# EAGLE design HC-SR04_to_I2C_v1 (EAGLE 7.5.0)
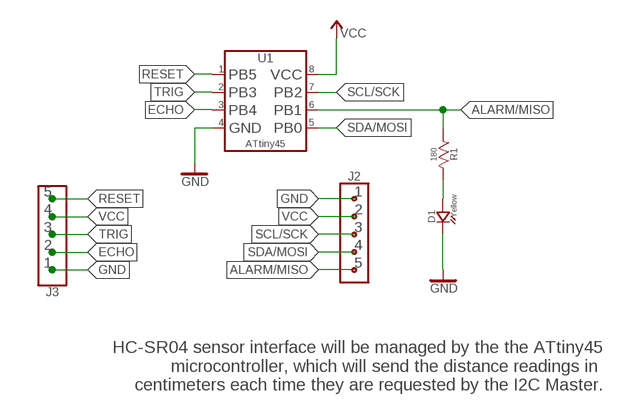
[diagram p0: schematic, sheet 1]

## Parts
D1  Yellow  LED_0805[2012]  [0805[2012]]
J2  PIN_HEADER_1X05_0.1"_STR_G[1]_PTH  [PIN_HEADER_1X05_0.1"_STR_G[1]_PTH]
J3  PIN_HEADER_1X05_0.1"_STR_G[1]_PTH  [PIN_HEADER_1X05_0.1"_STR_G[1]_PTH]
R1  180  RESISTOR_0603[1008]  [0603[1608]]
U1  ATtiny45  ATTINY25/45/85_TSSOP_MO-153-AC  [TSSOP_MO-153-AC]

## Nets
ALARM/MISO: J2.5 R1.1 U1.6(PB1)
ECHO: J3.2 U1.3(PB4)
GND: D1.- J2.1 J3.1 U1.4(GND)
N$9: D1.+ R1.2
RESET: J3.5 U1.1(PB5)
SCL/SCK: J2.3 U1.7(PB2)
SDA/MOSI: J2.4 U1.5(PB0)
TRIG: J3.3 U1.2(PB3)
VCC: J2.2 J3.4 U1.8(VCC)

## Notes on the sheet
- HC-SR04 sensor interface will be managed by the the ATtiny45
  microcontroller, which will send the distance readings in 
  centimeters each time they are requested by the I2C Master.

## Library data of the parts
D1 = LuisLab-LED:LED: LED 5MM
J2 J3 = LuisLab-Connectors:PIN_HEADER_1X05
R1 = LuisLab-Pasives:RESISTOR: Sschematic elements and footprints resistors
U1 = LuisLab-IntegratedCircuits:ATTINY25/45/85: Pin Descriptions - Port B (PB5:PB0) PB0 (MOSI/DI/SDA/AIN0/OC0A/OC1A/AREF/PCINT0) PB1 (MISO/DO/AIN1/OC0B/OC1A/PCINT1) PB2 (SCK/USCK/SCL/ADC1/T0/INT0/PCINT2) PB3 (PCINT3/XTAL1/CLKI/OC1B/ADC3) PB4 (PCINT4/XTAL2/CLKO/OC1B/ADC2) PB5 (PCINT5/RESET/ADC0/dW) NOTE: TSSOP only for ATtiny45/V

## Board
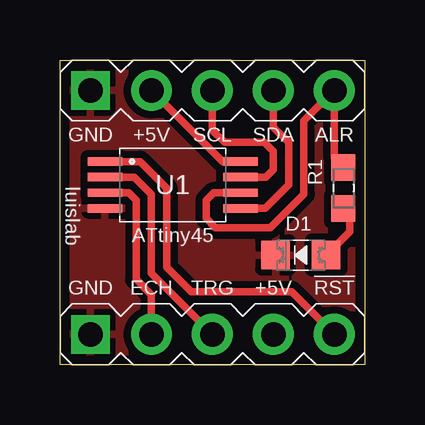
[diagram p1: board, top side]
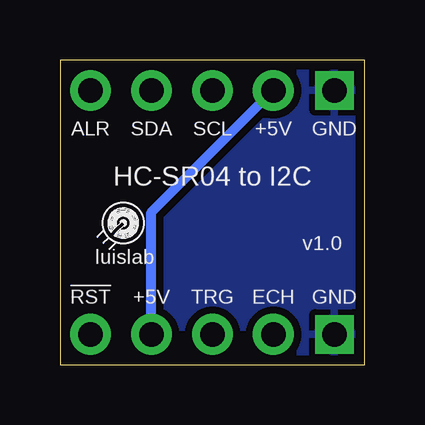
[diagram p2: board, bottom side, seen from below]

Size 12.7 x 12.7 mm. Coordinates in mm from the lower left corner, seen from the top.
Outline: 12.7,12.7 12.7,0 0,0 0,12.7 12.7,12.7
Copper layers (1*16): Top 0.0356mm / dielectric 1.5011mm / Bottom 0.0356mm
Design rules "LaenPCBOrder": minimum track width 6mil, minimum drill 13mil, track to track 6mil, track to pad 6mil, pad to pad 6mil, via to via 6mil, smd to smd 6mil, copper to edge 15mil, drill to drill 6mil, minimum pad ring 7mil, minimum via ring 7mil, stop-mask expansion 3mil, vias tented up to drill 0mil, thermal gap 10mil

### Footprints (pad centres in the part's own frame; a part is rotated, then mirrored left to right if it is on the bottom)
0805[2012] = smd 1.2 x 1.2: + 1.05,0; - -1.05,0
PIN_HEADER_1X05_0.1"_STR_G[1]_PTH = drill 1.016 pad 1.6 square: 1 -6.35,0 | drill 1.016 pad 1.7: 2 -3.81,0; 3 -1.27,0; 4 1.27,0; 5 3.81,0
0603[1608] = smd 1.1 x 1: 1 -0.85,0; 2 0.85,0
TSSOP_MO-153-AC = smd 0.35 x 1.45: 1 -0.975,-2.825; 2 -0.325,-2.825; 3 0.325,-2.825; 4 0.975,-2.825; 5 0.975,2.825; 6 0.325,2.825; 7 -0.325,2.825; 8 -0.975,2.825

### Placement (x,y rotation side)
D1  10.03,4.57 0 top
J2  7.62,11.43 0 top
J3  7.62,1.27 0 top
R1  11.81,7.37 270 top
U1  4.7,7.49 270 top

### Tracks (layer width: path | path; a pad name or v marks a point on that pad's centre or on a via)
ALARM/MISO
  Top 0.305: U1.6 6.41,7.17 6.1,6.86 6.1,6.1 6.48,5.71 8.76,5.71 10.16,7.11 10.16,10.16 J2.5 11.43,8.64 R1.1
ECHO
  Top 0.305: U1.3 2.86,7.17 3.17,6.86 3.17,3.56 3.81,2.92 J3.2
GND
  pour Bottom (isolate 0.305, rank 6): -1.27,17.78 13.97,17.78 13.97,-3.81 -1.27,-3.81
  pour Top (isolate 0.305, rank 6): -5.08,-2.54 17.78,-2.54 17.78,15.24 -5.08,15.24
N$9
  Top 0.305: D1.+ 12.06,5.55 12.06,6.26 arc90 R1.2
RESET
  Top 0.305: U1.1 3.34,8.47 4.45,7.37 4.45,4.06 5.46,3.05 9.65,3.05 J3.5
SCL/SCK
  Top 0.305: J2.3 6.35,9.78 6.86,9.27 8.51,9.27 8.89,8.89 8.89,8.13 8.58,7.82 U1.7
SDA/MOSI
  Top 0.305: U1.5 8.55,6.52 9.52,7.49 9.52,9.27 8.89,9.91 J2.4
TRIG
  Top 0.305: U1.2 3.1,7.82 3.81,7.11 3.81,3.81 J3.3
VCC
  Top 0.305: U1.8 6.77,8.47 J2.2
  Bottom 0.406: J3.4 8.89,6.35 J2.2

### Text on the board
tPlace: GND | +5V | SCL | SDA | ALR | luislab | GND | ECH | TRG | +5V | !RST!
bPlace: GND | +5V | SCL | SDA | ALR | HC-SR04 to I2C | v1.0 | luislab | GND | ECH | TRG | +5V | !RST!